# Altium schematic sheet BuckConverterAP64500.SchDoc
size Letter; SheetNumber: 1; SheetTotal: 1
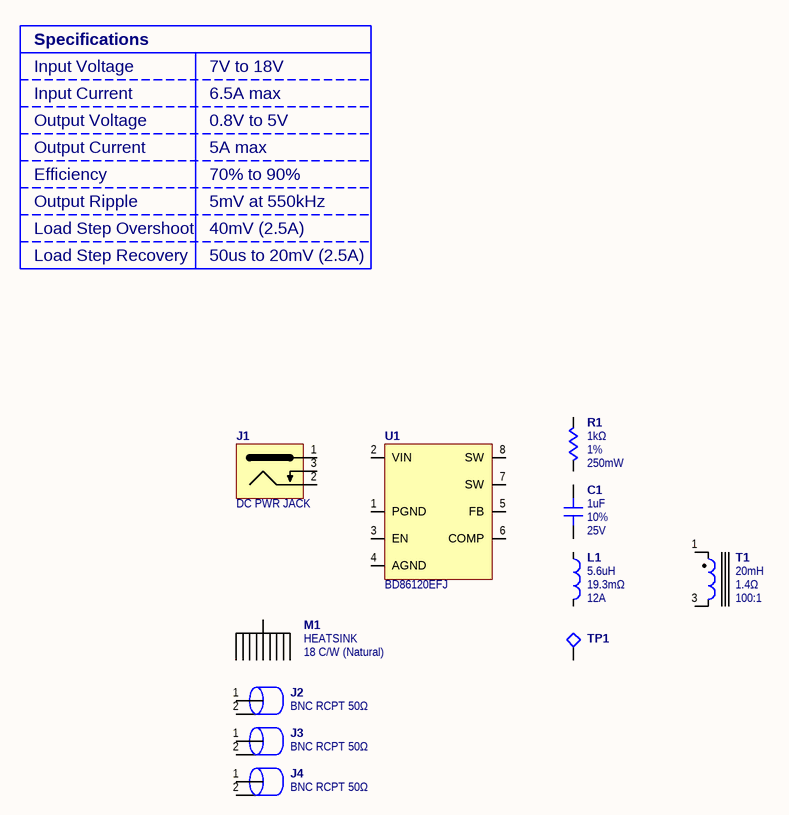
[diagram p0: BuckConverterAP64500.SchDoc]

## Parts
C1  value 1uF  Voltage: 25V  Tolerance: 10%  (hidden comment: 1276-1066-1-ND)
J1  DC PWR JACK
J2  BNC RCPT 50Ω
J3  BNC RCPT 50Ω
J4  BNC RCPT 50Ω
L1  value 5.6uH  Irms: 12A  DCR: 19.3mΩ  (hidden comment: SRP1038C-5R6MCT-ND)
M1  HEATSINK  Theta: 18 C/W (Natural)
R1  value 1kΩ  Tolerance: 1%  Power: 250mW  (hidden comment: RNCP0805FTD1K00CT-ND)
T1  value 20mH  N: 100:1  DCR: 1.4Ω  (hidden comment: 553-1543-ND)
TP1  36-1033-ND  (value not drawn)
U1  BD86120EFJ

## Nets

Not connected (* = marked no-connect by the designer): C1 1 2; J1 1(9) 2(11) 3(10); J2 1(12) 2(12); J3 1(12) 2(12); J4 1(12) 2(12); L1 1 2; M1 1(8); R1 1 2; T1 1 3; TP1 1(12); U1 1(PGND) 2(VIN) 3(EN) 4(AGND) 5(FB) 6(COMP) 7(SW) 8(SW)

## Notes on the sheet
- Specifications
- Input Voltage
- 7V to 18V
- Input Current
- Output Voltage
- 6.5A max
- 0.8V to 5V
- Output Current
- Efficiency
- Output Ripple
- 5A max
- 70% to 90%
- 5mV at 550kHz
- Load Step Overshoot
- Load Step Recovery
- 40mV (2.5A)
- 50us to 20mV (2.5A)

## Library data of the parts
C1 = CAP-1U00-10T0-25V0-0805: CAP, 1.0uF ±10.0%, 25V, 0805; Supplier 1: Digi-Key; Supplier Part Number 1: 1276-1066-1-ND
J1 = DC-PWR-JACK: DC Power Jack, 48V, 6.5A; Supplier 1: Digi-Key; Supplier Part Number 1: 839-54-00165CT-ND
J2-J4 = BNC-RCPT: BNC Receptacle, 50Ω; Supplier 1: Digi-Key; Supplier Part Number 1: WM5524-ND
L1 = IND-5U60-20T0-12A0: IND, 5.6uH ±20.0%, 19.3mΩ DCR, 12A Irms; Supplier 1: Digi-Key; Supplier Part Number 1: SRP1038C-5R6MCT-ND
M1 = ATS-PCB1073: Heatsink, 18C/W @ Natural; Supplier 1: Digi-Key; Supplier Part Number 1: ATS2115-ND
R1 = RES-1K00-1T00-W250-0805: RES, 1.00kΩ ±1.00%, 250mW, 0805; Supplier 1: Digi-Key; Supplier Part Number 1: RNCP0805FTD1K00CT-ND
T1 = XFMR-20M0-100N: XFMR, 20mH, 1.4Ω DCR, 100:1; Supplier 1: Digi-Key; Supplier Part Number 1: 553-1543-ND
TP1 = TEST-POINT: Test Point Loop; Supplier 1: Digi-Key; Supplier Part Number 1: 36-1033-ND
U1 = BD86120EFJ: Synchronous Buck Converter, 4.5V-18V, 5A; Supplier 1: Digi-Key; Supplier Part Number 1: BD86120EFJ-E2CT-ND